# Altium project PnP.PrjPcb (part 2 of 2)

## Sheet ENET.SchDoc: ENET PHY
size 431 x 279 mm; Author: Shivam Sharma; SheetNumber: 9; SheetTotal: 13; SheetRevision: 1.0
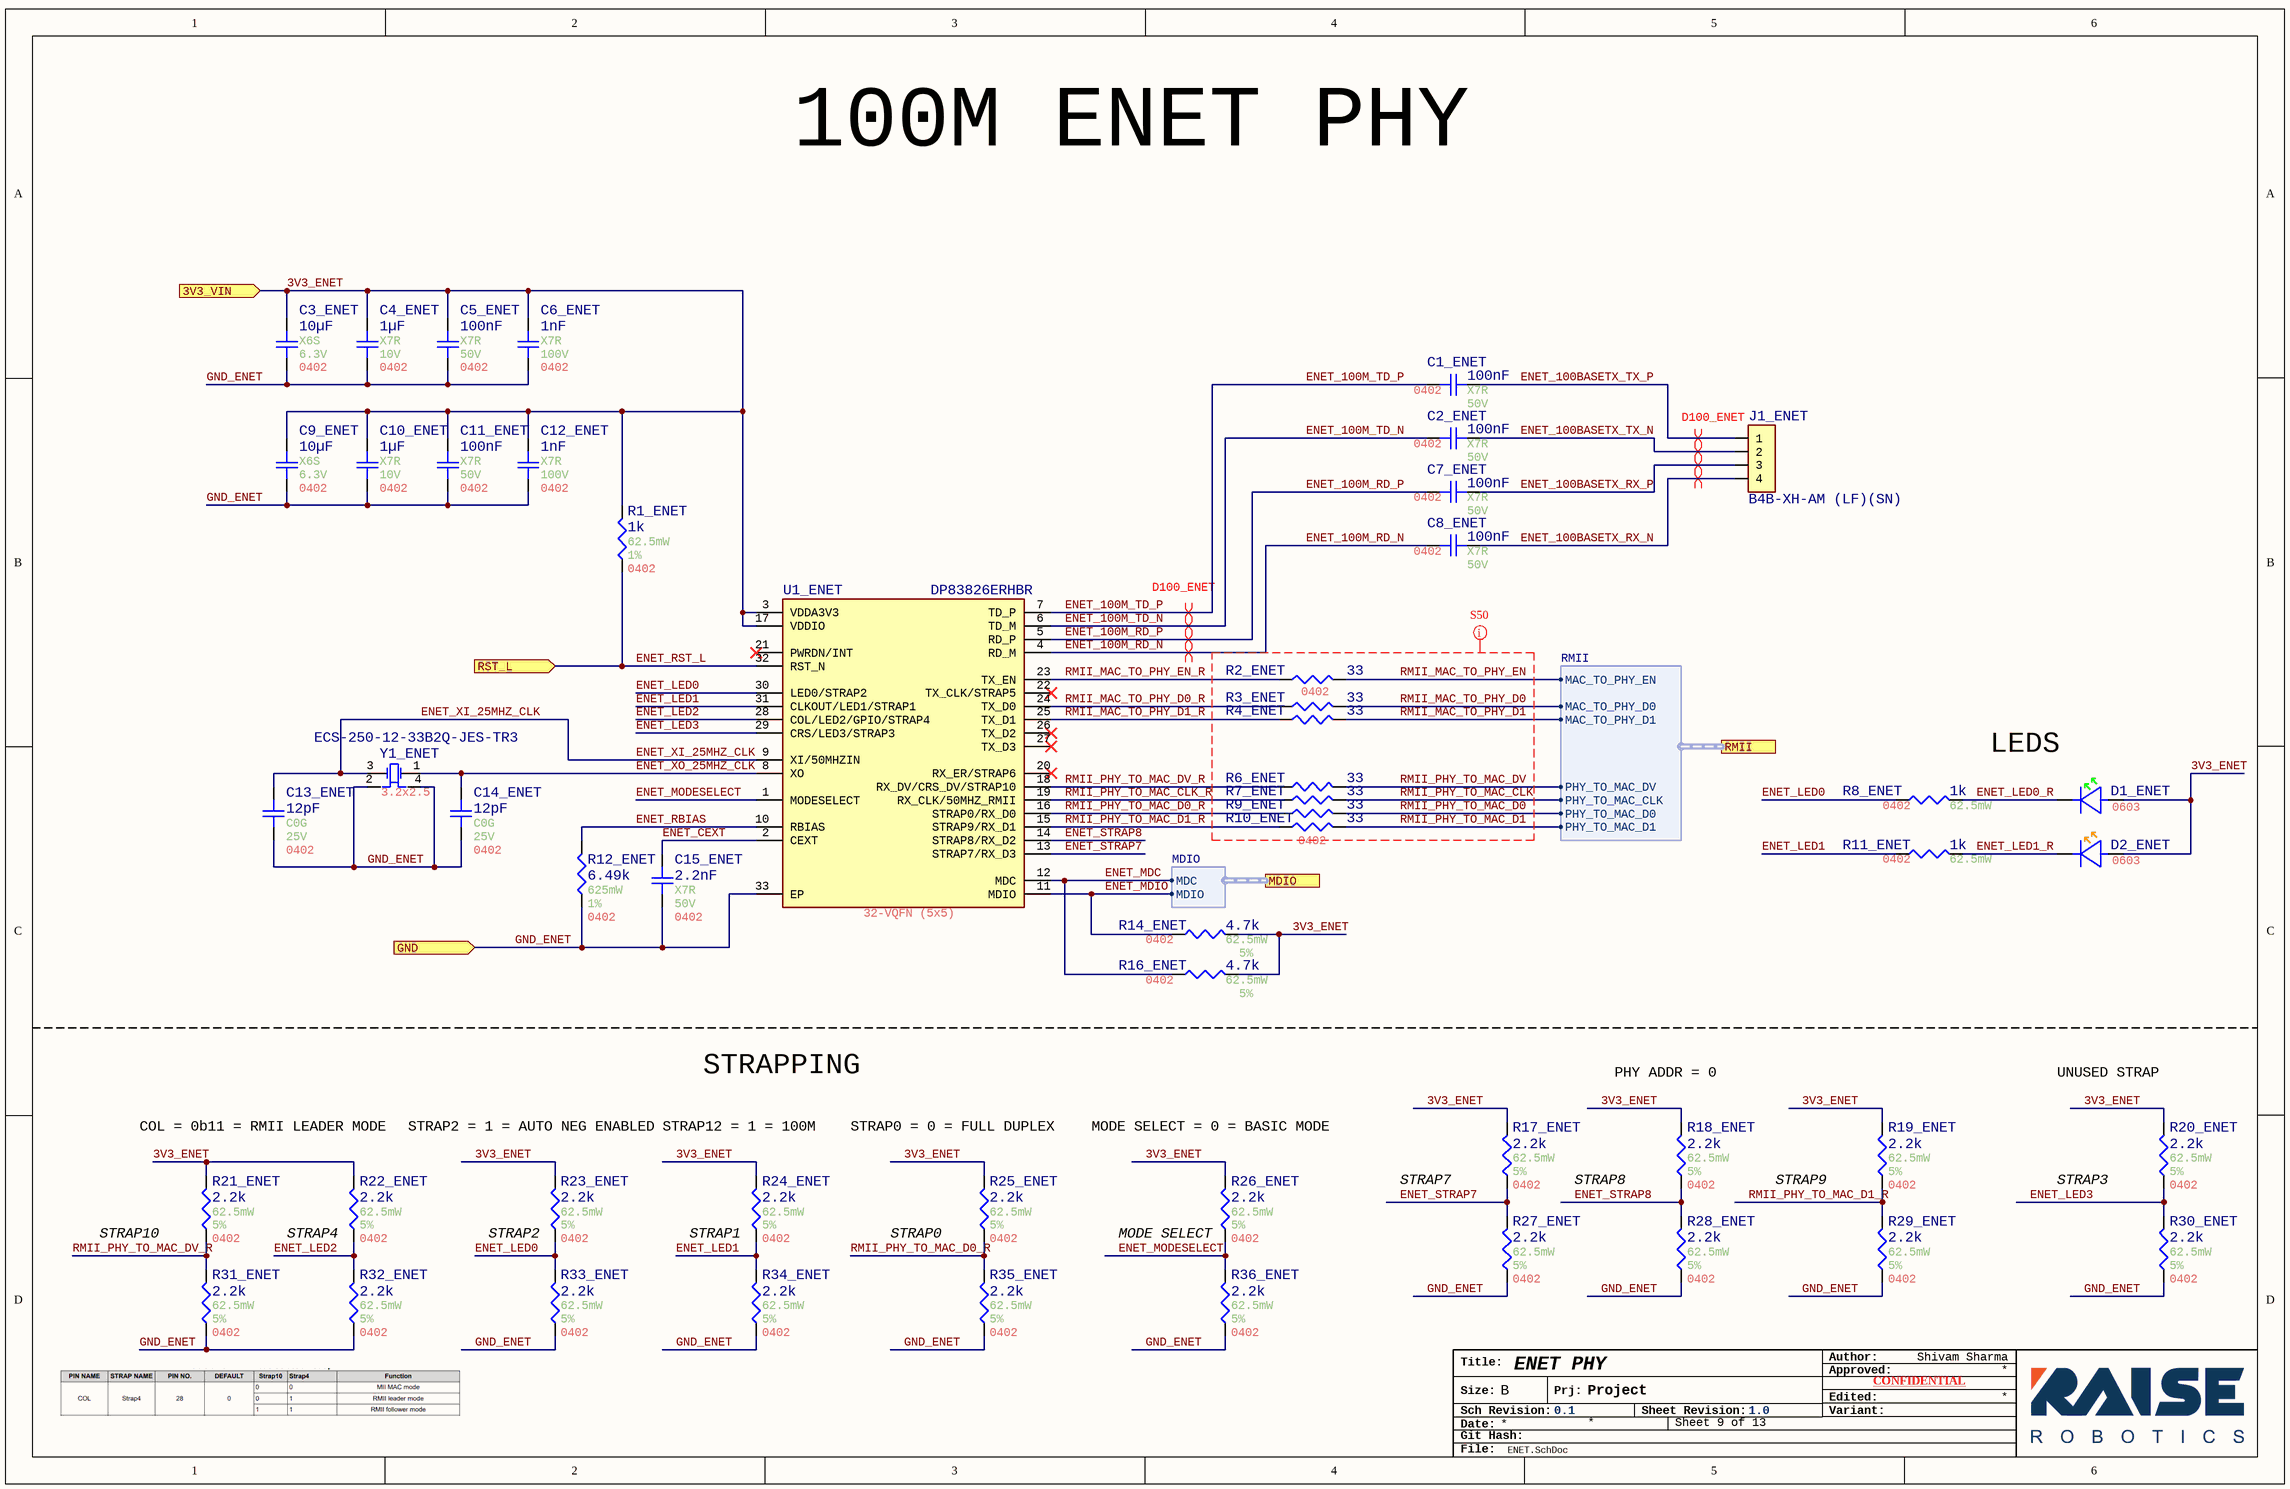
[diagram p6: ENET.SchDoc]

### Parts
C1_ENET  value 100nF  Temperature Coefficient: X7R  Voltage Rating: 50V  Case/Package: 0402  [Generic 0402 capacitor]  (hidden comment: GRT155R71H104KE01D)
C2_ENET  value 100nF  Temperature Coefficient: X7R  Voltage Rating: 50V  Case/Package: 0402  [Generic 0402 capacitor]  (hidden comment: GRT155R71H104KE01D)
C3_ENET  value 10µF  Temperature Coefficient: X6S  Voltage Rating: 6.3V  Case/Package: 0402  [Generic 0402 capacitor]  (hidden comment: GRT155C80J106ME13J)
C4_ENET  value 1µF  Temperature Coefficient: X7R  Voltage Rating: 10V  Case/Package: 0402  [Generic 0402 capacitor]  (hidden comment: MAASL105CD7105MFCA01)
C5_ENET  value 100nF  Temperature Coefficient: X7R  Voltage Rating: 50V  Case/Package: 0402  [Generic 0402 capacitor]  (hidden comment: GRT155R71H104KE01D)
C6_ENET  value 1nF  Temperature Coefficient: X7R  Voltage Rating: 100V  Case/Package: 0402  [Generic 0402 capacitor]  (hidden comment: GCM155R72A102KA37J)
C7_ENET  value 100nF  Temperature Coefficient: X7R  Voltage Rating: 50V  Case/Package: 0402  [Generic 0402 capacitor]  (hidden comment: GRT155R71H104KE01D)
C8_ENET  value 100nF  Temperature Coefficient: X7R  Voltage Rating: 50V  Case/Package: 0402  [Generic 0402 capacitor]  (hidden comment: GRT155R71H104KE01D)
C9_ENET  value 10µF  Temperature Coefficient: X6S  Voltage Rating: 6.3V  Case/Package: 0402  [Generic 0402 capacitor]  (hidden comment: GRT155C80J106ME13J)
C10_ENET  value 1µF  Temperature Coefficient: X7R  Voltage Rating: 10V  Case/Package: 0402  [Generic 0402 capacitor]  (hidden comment: MAASL105CD7105MFCA01)
C11_ENET  value 100nF  Temperature Coefficient: X7R  Voltage Rating: 50V  Case/Package: 0402  [Generic 0402 capacitor]  (hidden comment: GRT155R71H104KE01D)
C12_ENET  value 1nF  Temperature Coefficient: X7R  Voltage Rating: 100V  Case/Package: 0402  [Generic 0402 capacitor]  (hidden comment: GCM155R72A102KA37J)
C13_ENET  value 12pF  Temperature Coefficient: C0G  Voltage Rating: 25V  Case/Package: 0402  [Generic 0402 capacitor]  (hidden comment: GRT1555C1E120JA02J)
C14_ENET  value 12pF  Temperature Coefficient: C0G  Voltage Rating: 25V  Case/Package: 0402  [Generic 0402 capacitor]  (hidden comment: GRT1555C1E120JA02J)
C15_ENET  value 2.2nF  Temperature Coefficient: X7R  Voltage Rating: 50V  Case/Package: 0402  [Generic 0402 capacitor]  (hidden comment: CGA2B2X7R1H222K050BA)
D1_ENET  Case/Package: 0603  [SML-D12P8WT86C]  (hidden comment: SML-D12P8WT86C)
D2_ENET  Case/Package: 0603  [FP-SML-D12-MFG]  (hidden comment: SML-D12D8WT86C)
J1_ENET  B4B-XH-AM (LF)(SN)  [FP-B4B-XH-AM_LF_SN-MFG]
R1_ENET  value 1k  Power: 62.5mW  Tolerance: 1%  Case/Package: 0402  [Generic 0402 Resistor]  (hidden comment: WR04X1001FTL)
R2_ENET  value 33  [Generic 0402 Resistor]  (hidden comment: RMCA0402FT33R0-HP)
R3_ENET  value 33  [Generic 0402 Resistor]  (hidden comment: RMCA0402FT33R0-HP)
R4_ENET  value 33  Case/Package: 0402  [Generic 0402 Resistor]  (hidden comment: RMCA0402FT33R0-HP)
R6_ENET  value 33  [Generic 0402 Resistor]  (hidden comment: RMCA0402FT33R0-HP)
R7_ENET  value 33  [Generic 0402 Resistor]  (hidden comment: RMCA0402FT33R0-HP)
R8_ENET  value 1k  Power: 62.5mW  Case/Package: 0402  [Generic 0402 Resistor]  (hidden comment: WR04X1001FTL)
R9_ENET  value 33  [Generic 0402 Resistor]  (hidden comment: RMCA0402FT33R0-HP)
R10_ENET  value 33  Case/Package: 0402  [Generic 0402 Resistor]  (hidden comment: RMCA0402FT33R0-HP)
R11_ENET  value 1k  Power: 62.5mW  Case/Package: 0402  [Generic 0402 Resistor]  (hidden comment: WR04X1001FTL)
R12_ENET  value 6.49k  Power: 625mW  Tolerance: 1%  Case/Package: 0402  [Generic 0402 Resistor]  (hidden comment: AC0402FR-076K49L)
R14_ENET  value 4.7k  Power: 62.5mW  Tolerance: 5%  Case/Package: 0402  [Generic 0402 Resistor]  (hidden comment: WR04X472JTL)
R16_ENET  value 4.7k  Power: 62.5mW  Tolerance: 5%  Case/Package: 0402  [Generic 0402 Resistor]  (hidden comment: WR04X472JTL)
R17_ENET  value 2.2k  Power: 62.5mW  Tolerance: 5%  Case/Package: 0402  [Generic 0402 Resistor]  (hidden comment: CR0402-JW-222GLF)
R18_ENET  value 2.2k  Power: 62.5mW  Tolerance: 5%  Case/Package: 0402  [Generic 0402 Resistor]  (hidden comment: CR0402-JW-222GLF)
R19_ENET  value 2.2k  Power: 62.5mW  Tolerance: 5%  Case/Package: 0402  [Generic 0402 Resistor]  (hidden comment: CR0402-JW-222GLF)
R20_ENET  value 2.2k  Power: 62.5mW  Tolerance: 5%  Case/Package: 0402  [Generic 0402 Resistor]  (hidden comment: CR0402-JW-222GLF)
R21_ENET  value 2.2k  Power: 62.5mW  Tolerance: 5%  Case/Package: 0402  [Generic 0402 Resistor]  (hidden comment: CR0402-JW-222GLF)
R22_ENET  value 2.2k  Power: 62.5mW  Tolerance: 5%  Case/Package: 0402  [Generic 0402 Resistor]  (hidden comment: CR0402-JW-222GLF)
R23_ENET  value 2.2k  Power: 62.5mW  Tolerance: 5%  Case/Package: 0402  [Generic 0402 Resistor]  (hidden comment: CR0402-JW-222GLF)
R24_ENET  value 2.2k  Power: 62.5mW  Tolerance: 5%  Case/Package: 0402  [Generic 0402 Resistor]  (hidden comment: CR0402-JW-222GLF)
R25_ENET  value 2.2k  Power: 62.5mW  Tolerance: 5%  Case/Package: 0402  [Generic 0402 Resistor]  (hidden comment: CR0402-JW-222GLF)
R26_ENET  value 2.2k  Power: 62.5mW  Tolerance: 5%  Case/Package: 0402  [Generic 0402 Resistor]  (hidden comment: CR0402-JW-222GLF)
R27_ENET  value 2.2k  Power: 62.5mW  Tolerance: 5%  Case/Package: 0402  [Generic 0402 Resistor]  (hidden comment: CR0402-JW-222GLF)
R28_ENET  value 2.2k  Power: 62.5mW  Tolerance: 5%  Case/Package: 0402  [Generic 0402 Resistor]  (hidden comment: CR0402-JW-222GLF)
R29_ENET  value 2.2k  Power: 62.5mW  Tolerance: 5%  Case/Package: 0402  [Generic 0402 Resistor]  (hidden comment: CR0402-JW-222GLF)
R30_ENET  value 2.2k  Power: 62.5mW  Tolerance: 5%  Case/Package: 0402  [Generic 0402 Resistor]  (hidden comment: CR0402-JW-222GLF)
R31_ENET  value 2.2k  Power: 62.5mW  Tolerance: 5%  Case/Package: 0402  [Generic 0402 Resistor]  (hidden comment: CR0402-JW-222GLF)
R32_ENET  value 2.2k  Power: 62.5mW  Tolerance: 5%  Case/Package: 0402  [Generic 0402 Resistor]  (hidden comment: CR0402-JW-222GLF)
R33_ENET  value 2.2k  Power: 62.5mW  Tolerance: 5%  Case/Package: 0402  [Generic 0402 Resistor]  (hidden comment: CR0402-JW-222GLF)
R34_ENET  value 2.2k  Power: 62.5mW  Tolerance: 5%  Case/Package: 0402  [Generic 0402 Resistor]  (hidden comment: CR0402-JW-222GLF)
R35_ENET  value 2.2k  Power: 62.5mW  Tolerance: 5%  Case/Package: 0402  [Generic 0402 Resistor]  (hidden comment: CR0402-JW-222GLF)
R36_ENET  value 2.2k  Power: 62.5mW  Tolerance: 5%  Case/Package: 0402  [Generic 0402 Resistor]  (hidden comment: CR0402-JW-222GLF)
U1_ENET  DP83826ERHBR  Case/Package: 32-VQFN (5x5)  [DP83826ERHBR]
Y1_ENET  ECS-250-12-33B2Q-JES-TR3  Case/Package: 3.2x2.5  [ECS-250-12-33B2Q-JES-TR3]

### Ports
3V3_VIN (in), GND (in), MDIO (harness MDIO), RMII (harness RMII), RST_L (in)

### Harnesses
MDIO: MDIO, MDC
RMII: MAC_TO_PHY_D0, MAC_TO_PHY_D1, PHY_TO_MAC_D0, PHY_TO_MAC_CLK, PHY_TO_MAC_D1, MAC_TO_PHY_EN, PHY_TO_MAC_DV

### Nets
3V3_ENET: C3_ENET.2 C4_ENET.2 C5_ENET.2 C6_ENET.2 C9_ENET.2 C10_ENET.2 C11_ENET.2 C12_ENET.2 D1_ENET.2(A) D2_ENET.2(A) R1_ENET.2 R14_ENET.2 R16_ENET.2 R17_ENET.2 R18_ENET.2 R19_ENET.2 R20_ENET.2 R21_ENET.2 R22_ENET.2 R23_ENET.2 R24_ENET.2 R25_ENET.2 R26_ENET.2 U1_ENET.3(VDDA3V3) U1_ENET.17(VDDIO) ; port 3V3_VIN  [project net 3V3_LOGIC]
GND_ENET: C3_ENET.1 C4_ENET.1 C5_ENET.1 C6_ENET.1 C9_ENET.1 C10_ENET.1 C11_ENET.1 C12_ENET.1 C13_ENET.1 C14_ENET.1 C15_ENET.1 R12_ENET.1 R27_ENET.1 R28_ENET.1 R29_ENET.1 R30_ENET.1 R31_ENET.1 R32_ENET.1 R33_ENET.1 R34_ENET.1 R35_ENET.1 R36_ENET.1 U1_ENET.33(EP) Y1_ENET.2 Y1_ENET.4 ; port GND  [project net GND]
ENET_100BASETX_RX_N: C8_ENET.1 J1_ENET.4
ENET_100BASETX_RX_P: C7_ENET.1 J1_ENET.3
ENET_100BASETX_TX_N: C2_ENET.1 J1_ENET.2
ENET_100BASETX_TX_P: C1_ENET.1 J1_ENET.1
ENET_100M_RD_N: C8_ENET.2 U1_ENET.4(RD_M)
ENET_100M_RD_P: C7_ENET.2 U1_ENET.5(RD_P)
ENET_100M_TD_N: C2_ENET.2 U1_ENET.6(TD_M)
ENET_100M_TD_P: C1_ENET.2 U1_ENET.7(TD_P)
ENET_CEXT: C15_ENET.2 U1_ENET.2(CEXT)
ENET_LED0: R8_ENET.1 R23_ENET.1 R33_ENET.2 U1_ENET.30(LED0/STRAP2)
ENET_LED0_R: D1_ENET.1(C) R8_ENET.2
ENET_LED1: R11_ENET.1 R24_ENET.1 R34_ENET.2 U1_ENET.31(CLKOUT/LED1/STRAP1)
ENET_LED1_R: D2_ENET.1(C) R11_ENET.2
ENET_LED2: R22_ENET.1 R32_ENET.2 U1_ENET.28(COL/LED2/GPIO/STRAP4)
ENET_LED3: R20_ENET.1 R30_ENET.2 U1_ENET.29(CRS/LED3/STRAP3)
ENET_MDC: R16_ENET.1 U1_ENET.12(MDC) ; port MDIO.MDC
ENET_MDIO: R14_ENET.1 U1_ENET.11(MDIO) ; port MDIO.MDIO
ENET_MODESELECT: R26_ENET.1 R36_ENET.2 U1_ENET.1(MODESELECT)
ENET_RBIAS: R12_ENET.2 U1_ENET.10(RBIAS)
ENET_RST_L: R1_ENET.1 U1_ENET.32(RST_N) ; port RST_L
ENET_STRAP7: R17_ENET.1 R27_ENET.2 U1_ENET.13(STRAP7/RX_D3)
ENET_STRAP8: R18_ENET.1 R28_ENET.2 U1_ENET.14(STRAP8/RX_D2)
ENET_XI_25MHZ_CLK: C13_ENET.2 U1_ENET.9(XI/50MHZIN) Y1_ENET.3
ENET_XO_25MHZ_CLK: C14_ENET.2 U1_ENET.8(XO) Y1_ENET.1
RMII_MAC_TO_PHY_D0: R3_ENET.2 ; port RMII.MAC_TO_PHY_D0
RMII_MAC_TO_PHY_D0_R: R3_ENET.1 U1_ENET.24(TX_D0)
RMII_MAC_TO_PHY_D1: R4_ENET.2 ; port RMII.MAC_TO_PHY_D1
RMII_MAC_TO_PHY_D1_R: R4_ENET.1 U1_ENET.25(TX_D1)
RMII_MAC_TO_PHY_EN: R2_ENET.2 ; port RMII.MAC_TO_PHY_EN
RMII_MAC_TO_PHY_EN_R: R2_ENET.1 U1_ENET.23(TX_EN)
RMII_PHY_TO_MAC_CLK: R7_ENET.2 ; port RMII.PHY_TO_MAC_CLK
RMII_PHY_TO_MAC_CLK_R: R7_ENET.1 U1_ENET.19(RX_CLK/50MHZ_RMII)
RMII_PHY_TO_MAC_D0: R9_ENET.2 ; port RMII.PHY_TO_MAC_D0
RMII_PHY_TO_MAC_D0_R: R9_ENET.1 R25_ENET.1 R35_ENET.2 U1_ENET.16(STRAP0/RX_D0)
RMII_PHY_TO_MAC_D1: R10_ENET.2 ; port RMII.PHY_TO_MAC_D1
RMII_PHY_TO_MAC_D1_R: R10_ENET.1 R19_ENET.1 R29_ENET.2 U1_ENET.15(STRAP9/RX_D1)
RMII_PHY_TO_MAC_DV: R6_ENET.2 ; port RMII.PHY_TO_MAC_DV
RMII_PHY_TO_MAC_DV_R: R6_ENET.1 R21_ENET.1 R31_ENET.2 U1_ENET.18(RX_DV/CRS_DV/STRAP10)

Not connected (* = marked no-connect by the designer): U1_ENET 20(RX_ER/STRAP6)* 21(PWRDN/INT)* 22(TX_CLK/STRAP5)* 26(TX_D2)* 27(TX_D3)*

### Layout directives
differential pair; differential pair class D100_ENET: ENET_100BASETX_RX_N, ENET_100BASETX_RX_P, ENET_100BASETX_TX_N, ENET_100BASETX_TX_P, ENET_100M_RD_N, ENET_100M_RD_P, ENET_100M_TD_N, ENET_100M_TD_P
net class S50: RMII_MAC_TO_PHY_D0, RMII_MAC_TO_PHY_D1, RMII_MAC_TO_PHY_EN, RMII_PHY_TO_MAC_CLK, RMII_PHY_TO_MAC_D0, RMII_PHY_TO_MAC_D1, RMII_PHY_TO_MAC_DV

### Notes on the sheet
- 100M ENET PHY
- LEDS
- STRAPPING
- PHY ADDR = 0
- UNUSED STRAP
- COL = 0b11 = RMII LEADER MODE
- STRAP2 = 1 = AUTO NEG ENABLED
- STRAP12 = 1 = 100M
- STRAP0 = 0 = FULL DUPLEX
- MODE SELECT = 0 = BASIC MODE
- STRAP10
- (near R22_ENET) STRAP4
- (near R23_ENET) STRAP2
- (near R24_ENET) STRAP1
- STRAP0
- (near R26_ENET) MODE SELECT
- STRAP7
- STRAP8
- STRAP9
- STRAP3
- Title:
- Author:
- Approved:
- Size:
- Date:
- Git Hash:
- Sch Revision:
- B
- Prj:
- Sheet Revision:
- Variant:
- Edited:
- CONFIDENTIAL
- File:

### Library data of the parts
C1_ENET C2_ENET C5_ENET C7_ENET C8_ENET C11_ENET = CMP-001-00084-12: as C1 on sheet Top; Reach SVHC Compliant: Yes; Mounting Technology: Surface Mount; Termination: Wraparound; Pins: 2; Packaging: Tape and Reel; Package Shape: Rectangular; Multilayer: Yes; Tolerance: 10%; Max Operating Temperature: 125°C; Terminal Finish: Nickel; Capacitor Type: Ceramic; Dielectric Material: Ceramic; Min Operating Temperature: -55°C; RoHS Compliant: Yes
C3_ENET C9_ENET = CMP-001-00108-2: as C9_MCU on sheet MCU; Mounting Technology: Surface Mount; Max Operating Temperature: 105°C; Min Operating Temperature: -55°C; Tolerance: 20%; Pins: 2; RoHS Compliant: Yes; Capacitor Type: Ceramic
C4_ENET C10_ENET = CMP-001-00104-2: Cap Cer 1UF 20V X7T 0402; Capacitor Type: Ceramic; AECQ: Yes; Tolerance: 20%; Max Operating Temperature: 125°C; Min Operating Temperature: -55°C; Mounting Technology: Surface Mount; RoHS Compliant: Yes; Pins: 2
C6_ENET C12_ENET = CMP-001-00101-2: Ceramic Capacitor, Multilayer, Ceramic, 100V, 10% +Tol, 10% -Tol, X7R, 15% TC, 0.001uF, Surface Mount, 0402; AECQ: Yes; Pins: 2; Tolerance: 10%; Max Operating Temperature: 125°C; Capacitor Type: Ceramic; Mounting Technology: SMD; Min Operating Temperature: -55°C
C13_ENET C14_ENET = CMP-001-00109-2: Ceramic Capacitor, Multilayer, Ceramic, 25V, 5% +Tol, 5% -Tol, C0G, 30ppm/Cel TC, 0.000012uF, Surface Mount, 0402; AECQ: Yes; Pins: 2; Mounting Technology: Surface Mount; Min Operating Temperature: -55°C; RoHS Compliant: Yes; Max Operating Temperature: 125°C; Tolerance: 5%; Capacitor Type: Ceramic
C15_ENET = CMP-001-00093-4: 50V 2.2nF X7R 卤10% 0402 Multilayer Ceramic Capacitors MLCC - SMD/SMT ROHS; Multilayer: Yes; Tolerance: 10%; Max Operating Temperature: 150°C; AECQ: Yes; Reach SVHC Compliant: Yes; Package Shape: Rectangular; Dielectric Material: Ceramic; Min Operating Temperature: -55°C; Packaging: Tape and Reel; RoHS Compliant: Yes; Capacitor Type: Ceramic; Mounting Technology: Surface Mount; Pins: 2
D1_ENET = CMP-007-00039-1: Green 560nm LED Indication - Discrete 2.2V 0603 (1608 Metric); Forward Voltage: 2.2V; Pins: 2; Colour: Green
D2_ENET = CMP-007-00038-1: Orange 605nm LED Indication - Discrete 2.2V 0603 (1608 Metric); Colour: Orange; Forward Voltage: 2.2V; Pins: 2
J1_ENET = CMP-002-00133-1: Header, Xh, Top, 4Way, 2.5Mm, Boss;; Manufacturer: JST; Max Current Rating: 3A; Gender: Male; Pitch: 2.4892mm; Voltage Rating: 250V; Length: 12.4mm; Min Operating Temperature: -25°C; Max Operating Temperature: 85°C; Pins: 4; Manufacturer Series: XH; Case/Package: THT; Height: 7mm; Connector Type: Header
R1_ENET R8_ENET R11_ENET = CMP-009-00182-8: Fixed Resistor, Metal Glaze/thick Film, 0.0625W, 1000ohm, 50V, 1% +/-Tol, 100ppm/Cel, Surface Mount, 0402; Manufacturer Part Number: Blank; Package Width: 0.5mm; Rated Temperature: 70°C; AECQ: No; Package Length: 1mm; Additional Feature: LASER TRIMMABLE; Package Height: 0.35mm; Temperature Coefficient (ppm/Cel): 100; RoHS Compliant: Yes; Working Voltage: 50V; Min Operating Temperature: -55°C; Pins: 2; Reach SVHC Compliant: Yes; Technology: METAL GLAZE/THICK FILM; Terminal Finish: Nickel; Max Operating Temperature: 155°C; Resistor Type: FIXED RESISTOR; Package Shape: Rectangular; Mounting Technology: Surface Mount; Termination: Wraparound; JESD-609 Code: e3; Packaging: Tape and Reel; Construction: Chip
  R8_ENET R11_ENET: Tolerance: 1%
R2_ENET R3_ENET R4_ENET R6_ENET R7_ENET R9_ENET R10_ENET = CMP-009-00205-4: Fixed Resistor, Metal Glaze/thick Film, 0.1W, 33ohm, 50V, 1% +/-Tol, 100ppm/Cel, Surface Mount, 0402; Power: 625mW; AECQ: Yes; Tolerance: 1%; Max Operating Temperature: 155°C; Pins: 2; Min Operating Temperature: -55°C; Voltage Rating: 50V; Mounting Technology: SMD
  R2_ENET R3_ENET R6_ENET R7_ENET R9_ENET: Case/Package: 0402
R12_ENET = CMP-009-00204-3: Fixed Resistor, Metal Glaze/thick Film, 0.0625W, 6490ohm, 50V, 1% +/-Tol, 100ppm/Cel, Surface Mount, 0402; AECQ: Yes; Min Operating Temperature: -55°C; Max Operating Temperature: 155°C; Pins: 2; Mounting Technology: SMD
R14_ENET R16_ENET = CMP-009-00184-8: Fixed Resistor, Metal Glaze/thick Film, 0.0625W, 4700ohm, 50V, 5% +/-Tol, 100ppm/Cel, Surface Mount, 0402; Manufacturer Part Number: Blank; Package Height: 0.35mm; Package Length: 1mm; Rated Temperature: 70°C; Package Width: 0.5mm; AECQ: No; Temperature Coefficient (ppm/Cel): 200; Additional Feature: LASER TRIMMABLE; Mounting Technology: Surface Mount; Technology: METAL GLAZE/THICK FILM; RoHS Compliant: Yes; Resistor Type: FIXED RESISTOR; Package Shape: Rectangular; Pins: 2; Construction: Chip; Terminal Finish: Nickel; Max Operating Temperature: 155°C; Working Voltage: 50V; Packaging: Tape and Reel; Termination: Wraparound; JESD-609 Code: e3; Reach SVHC Compliant: Yes; Min Operating Temperature: -55°C
R17_ENET R18_ENET R19_ENET R20_ENET R21_ENET R22_ENET R23_ENET R24_ENET R25_ENET R26_ENET R27_ENET R28_ENET R29_ENET R30_ENET R31_ENET R32_ENET R33_ENET R34_ENET R35_ENET R36_ENET = CMP-009-00183-8: Fixed Resistor, Metal Glaze/thick Film, 0.0625W, 2200ohm, 50V, 5% +/-Tol, 200ppm/Cel, Surface Mount, 0402; Manufacturer Part Number: Blank; Package Width: 0.5mm; Rated Temperature: 70°C; AECQ: No; Package Length: 1mm; Package Height: 0.35mm; Temperature Coefficient (ppm/Cel): 200; RoHS Compliant: Yes; Working Voltage: 50V; Min Operating Temperature: -55°C; Pins: 2; Reach SVHC Compliant: No; Technology: RUTHENIUM OXIDE; Terminal Finish: Nickel; Max Operating Temperature: 125°C; Resistor Type: FIXED RESISTOR; Package Shape: Rectangular; Mounting Technology: Surface Mount; Termination: Wraparound; JESD-609 Code: e3; Packaging: Tape and Reel; Construction: Chip
U1_ENET = CMP-031-00009-2: Ethernet Transceiver, 1-Trnsvr, PQCC32; AECQ: No; Max Operating Temperature: 105°C; Min Operating Temperature: -40°C; Pins: 32; MPN: DP83826ERHBR
Y1_ENET = CMP-003-00030-1: Crystal 25.000 Mhz 12PF SMD; AECQ: Yes; ESR: 50; Frequency: 25MHz; Mounting Technology: SMD; Min Operating Temperature: -40°C; Load Capacitance: 12pF; Pins: 4; Max Operating Temperature: 125°C

## Sheet steppers.SchDoc: Steppers
size 431 x 279 mm; Author: Shivam Sharma; SheetNumber: 11; SheetTotal: 13; SheetRevision: 1.0
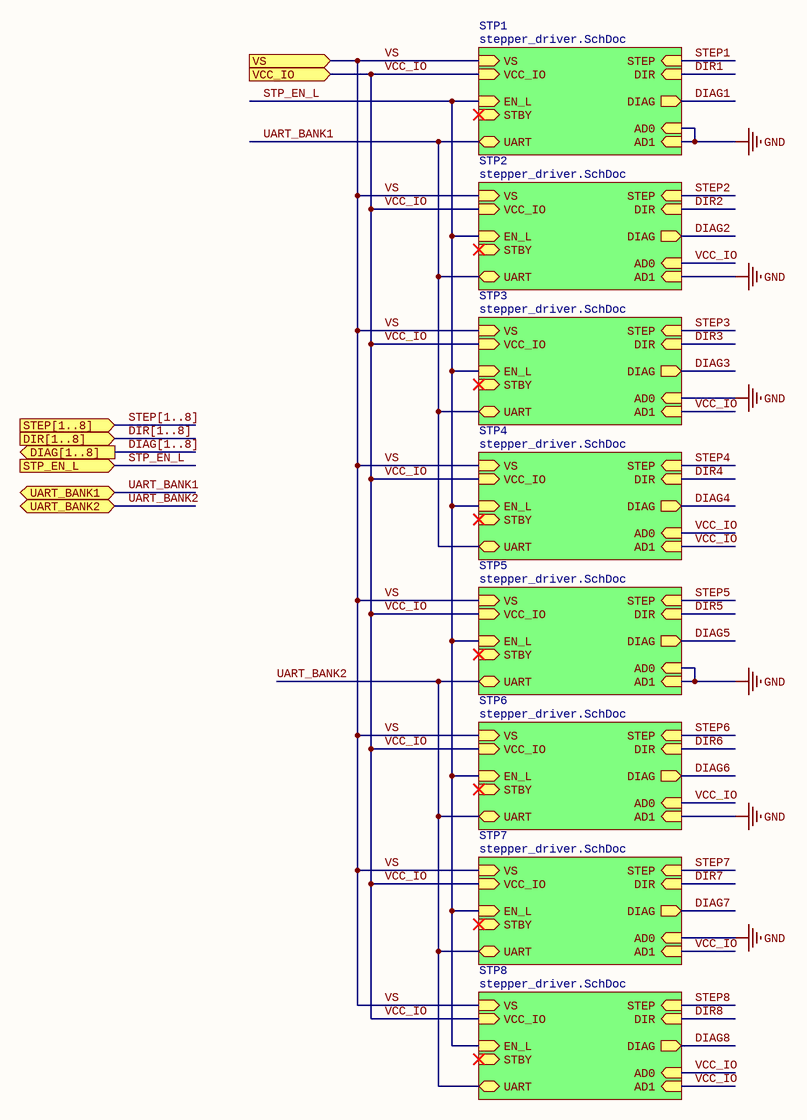
[diagram p7: steppers.SchDoc]

### Sub-sheets
STP1 = stepper_driver.SchDoc: VS (in), VCC_IO (in), STBY (in), EN_L (in), UART (bidir), DIR (in), STEP (in), AD0 (in), AD1 (in), DIAG (out)
STP2 = stepper_driver.SchDoc: VS (in), VCC_IO (in), STBY (in), EN_L (in), UART (bidir), DIR (in), STEP (in), AD0 (in), AD1 (in), DIAG (out)
STP3 = stepper_driver.SchDoc: VS (in), VCC_IO (in), STBY (in), EN_L (in), UART (bidir), DIR (in), STEP (in), AD0 (in), AD1 (in), DIAG (out)
STP4 = stepper_driver.SchDoc: VS (in), VCC_IO (in), STBY (in), EN_L (in), UART (bidir), DIR (in), STEP (in), AD0 (in), AD1 (in), DIAG (out)
STP5 = stepper_driver.SchDoc: VS (in), VCC_IO (in), STBY (in), EN_L (in), UART (bidir), DIR (in), STEP (in), AD0 (in), AD1 (in), DIAG (out)
STP6 = stepper_driver.SchDoc: VS (in), VCC_IO (in), STBY (in), EN_L (in), UART (bidir), DIR (in), STEP (in), AD0 (in), AD1 (in), DIAG (out)
STP7 = stepper_driver.SchDoc: VS (in), VCC_IO (in), STBY (in), EN_L (in), UART (bidir), DIR (in), STEP (in), AD0 (in), AD1 (in), DIAG (out)
STP8 = stepper_driver.SchDoc: VS (in), VCC_IO (in), STBY (in), EN_L (in), UART (bidir), DIR (in), STEP (in), AD0 (in), AD1 (in), DIAG (out)

### Ports
DIAG[1..8] (out), DIR[1..8] (in), STEP[1..8] (in), STP_EN_L (in), UART_BANK1 (bidir), UART_BANK2 (bidir), VCC_IO (in), VS (in)

### Nets
GND: sheet STP1/AD0, sheet STP1/AD1, sheet STP2/AD1, sheet STP3/AD0, sheet STP5/AD0, sheet STP5/AD1, sheet STP6/AD1, sheet STP7/AD0
VCC_IO: port VCC_IO, sheet STP1/VCC_IO, sheet STP2/VCC_IO, sheet STP2/AD0, sheet STP3/VCC_IO, sheet STP3/AD1, sheet STP4/VCC_IO, sheet STP4/AD0, sheet STP4/AD1, sheet STP5/VCC_IO, sheet STP6/VCC_IO, sheet STP6/AD0, sheet STP7/VCC_IO, sheet STP7/AD1, sheet STP8/VCC_IO, sheet STP8/AD0, sheet STP8/AD1  [project net 3V3_LOGIC]
VS: port VS, sheet STP1/VS, sheet STP2/VS, sheet STP3/VS, sheet STP4/VS, sheet STP5/VS, sheet STP6/VS, sheet STP7/VS, sheet STP8/VS  [project net 24V_MAIN]
STP_EN_L: port STP_EN_L, sheet STP1/EN_L, sheet STP2/EN_L, sheet STP3/EN_L, sheet STP4/EN_L, sheet STP5/EN_L, sheet STP6/EN_L, sheet STP7/EN_L, sheet STP8/EN_L  [project net STEPPERS_EN]
UART_BANK1: port UART_BANK1, sheet STP1/UART, sheet STP2/UART, sheet STP3/UART, sheet STP4/UART
UART_BANK2: port UART_BANK2, sheet STP5/UART, sheet STP6/UART, sheet STP7/UART, sheet STP8/UART

### Buses and harness runs
bus DIAG[1..8] = port DIAG[1..8]
bus DIR[1..8] = port DIR[1..8]
bus STEP[1..8] = port STEP[1..8]

### Notes on the sheet
- Title:
- Author:
- Approved:
- Size:
- Date:
- Git Hash:
- Sch Revision:
- B
- Prj:
- Sheet Revision:
- Variant:
- Edited:
- CONFIDENTIAL
- File:

## Sheet stepper_driver.SchDoc
size 431 x 279 mm; Author: Shivam Sharma; SheetNumber: 13; SheetTotal: 14
Used 8 times, as channels STP/STP1, STP/STP2, STP/STP3, STP/STP4, STP/STP5, STP/STP6, STP/STP7, STP/STP8. Parts and nets are listed once, with the designators drawn on the sheet.
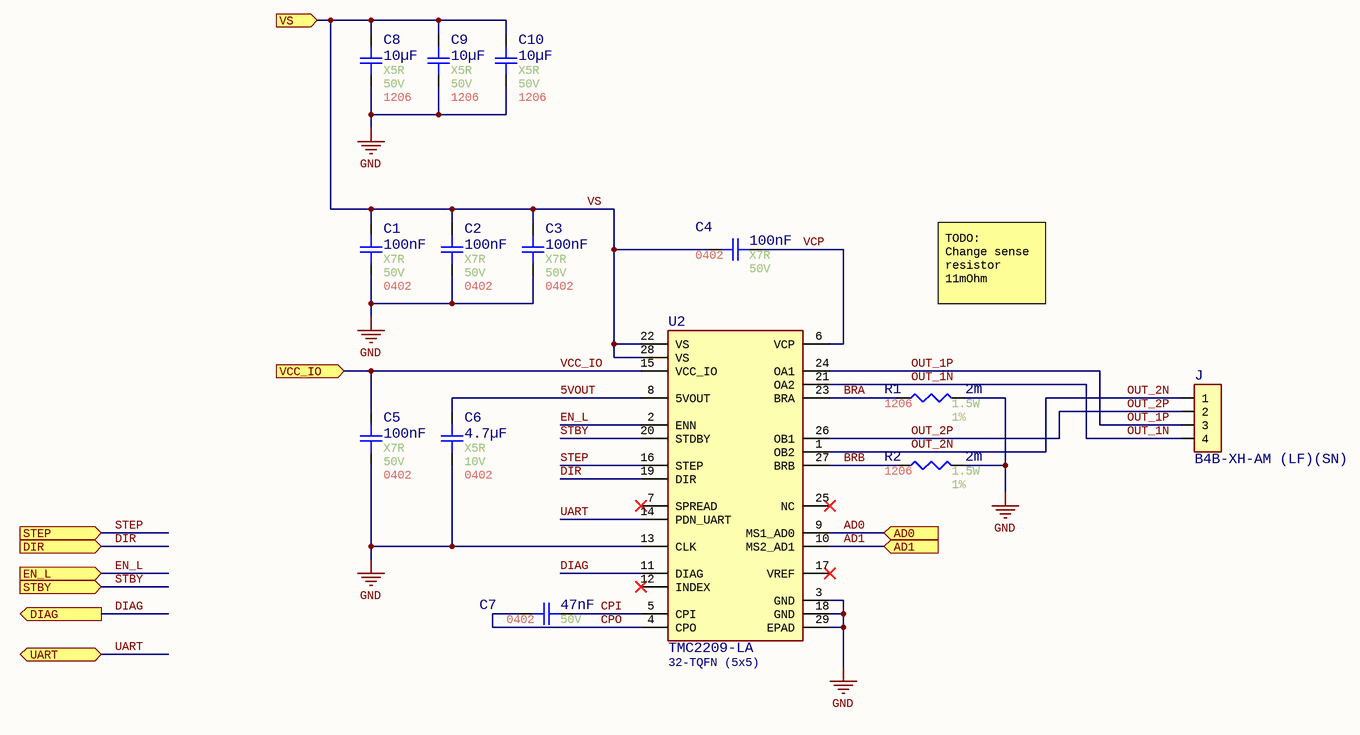
[diagram p8: stepper_driver.SchDoc]

### Parts
C1  value 100nF  Temperature Coefficient: X7R  Voltage Rating: 50V  Case/Package: 0402  [Generic 0402 capacitor]  (hidden comment: GRT155R71H104KE01D)
C2  value 100nF  Temperature Coefficient: X7R  Voltage Rating: 50V  Case/Package: 0402  [Generic 0402 capacitor]  (hidden comment: GRT155R71H104KE01D)
C3  value 100nF  Temperature Coefficient: X7R  Voltage Rating: 50V  Case/Package: 0402  [Generic 0402 capacitor]  (hidden comment: GRT155R71H104KE01D)
C4  value 100nF  Temperature Coefficient: X7R  Voltage Rating: 50V  Case/Package: 0402  [Generic 0402 capacitor]  (hidden comment: GRT155R71H104KE01D)
C5  value 100nF  Temperature Coefficient: X7R  Voltage Rating: 50V  Case/Package: 0402  [Generic 0402 capacitor]  (hidden comment: GRT155R71H104KE01D)
C6  value 4.7µF  Temperature Coefficient: X5R  Voltage Rating: 10V  Case/Package: 0402  [Generic 0402 capacitor]  (hidden comment: GRT155R61A475ME13D)
C7  value 47nF  Voltage Rating: 50V  Case/Package: 0402  [Generic 0402 capacitor]  (hidden comment: GRM155R71H473KE14D)
C8  value 10µF  Temperature Coefficient: X5R  Voltage Rating: 50V  Case/Package: 1206  [Generic 1206 Capacitor]  (hidden comment: CL31A106MBHNNNE)
C9  value 10µF  Temperature Coefficient: X5R  Voltage Rating: 50V  Case/Package: 1206  [Generic 1206 Capacitor]  (hidden comment: CL31A106MBHNNNE)
C10  value 10µF  Temperature Coefficient: X5R  Voltage Rating: 50V  Case/Package: 1206  [Generic 1206 Capacitor]  (hidden comment: CL31A106MBHNNNE)
J  B4B-XH-AM (LF)(SN)  [FP-B4B-XH-AM_LF_SN-MFG]
R1  value 2m  Power: 1.5W  Tolerance: 1%  Case/Package: 1206  [Generic 1206 resistor]  (hidden comment: PA1206FRM670R002L)
R2  value 2m  Power: 1.5W  Tolerance: 1%  Case/Package: 1206  [Generic 1206 resistor]  (hidden comment: PA1206FRM670R002L)
U2  TMC2209-LA  Case/Package: 32-TQFN (5x5)  [QFN-28_5x5x0.9mm_P0.5mm]

### Ports
AD0 (in), AD1 (in), DIAG (out), DIR (in), EN_L (in), STBY (in), STEP (in), UART (bidir), VCC_IO (in), VS (in)

### Nets
GND: C1.1 C2.1 C3.1 C5.1 C6.1 C8.1 C9.1 C10.1 R1.2 R2.2 U2.3(GND) U2.13(CLK) U2.18(GND) U2.29(EPAD)
5VOUT: C6.2 U2.8(5VOUT)
AD0: U2.9(MS1_AD0) ; port AD0
AD1: U2.10(MS2_AD1) ; port AD1
BRA: R1.1 U2.23(BRA)
BRB: R2.1 U2.27(BRB)
CPI: C7.1 U2.5(CPI)
CPO: C7.2 U2.4(CPO)
DIAG: U2.11(DIAG) ; port DIAG
DIR: U2.19(DIR) ; port DIR
EN_L: U2.2(ENN) ; port EN_L
OUT_1N: J.4 U2.21(OA2)
OUT_1P: J.3 U2.24(OA1)
OUT_2N: J.1 U2.1(OB2)
OUT_2P: J.2 U2.26(OB1)
STBY: U2.20(STDBY) ; port STBY
STEP: U2.16(STEP) ; port STEP
UART: U2.14(PDN_UART) ; port UART
VCC_IO: C5.2 U2.15(VCC_IO) ; port VCC_IO
VCP: C4.1 U2.6(VCP)
VS: C1.2 C2.2 C3.2 C4.2 C8.2 C9.2 C10.2 U2.22(VS) U2.28(VS) ; port VS

Not connected (* = marked no-connect by the designer): U2 7(SPREAD)* 12(INDEX)* 17(VREF)* 25(NC)*

### Channels
STP/STP1: designators end in _STP1; ports AD0=GND AD1=GND DIAG=DIAG1 DIR=DIR1 EN_L=STEPPERS_EN STBY=STBY_STP1 STEP=STEP1 UART=UART_BANK1 VCC_IO=3V3_LOGIC VS=24V_MAIN
STP/STP2: designators end in _STP2; ports AD0=3V3_LOGIC AD1=GND DIAG=DIAG2 DIR=DIR2 EN_L=STEPPERS_EN STBY=STBY_STP2 STEP=STEP2 UART=UART_BANK1 VCC_IO=3V3_LOGIC VS=24V_MAIN
STP/STP3: designators end in _STP3; ports AD0=GND AD1=3V3_LOGIC DIAG=DIAG3 DIR=DIR3 EN_L=STEPPERS_EN STBY=STBY_STP3 STEP=STEP3 UART=UART_BANK1 VCC_IO=3V3_LOGIC VS=24V_MAIN
STP/STP4: designators end in _STP4; ports AD0=3V3_LOGIC AD1=3V3_LOGIC DIAG=DIAG4 DIR=DIR4 EN_L=STEPPERS_EN STBY=STBY_STP4 STEP=STEP4 UART=UART_BANK1 VCC_IO=3V3_LOGIC VS=24V_MAIN
STP/STP5: designators end in _STP5; ports AD0=GND AD1=GND DIAG=DIAG5 DIR=DIR5 EN_L=STEPPERS_EN STBY=STBY_STP5 STEP=STEP5 UART=UART_BANK2 VCC_IO=3V3_LOGIC VS=24V_MAIN
STP/STP6: designators end in _STP6; ports AD0=3V3_LOGIC AD1=GND DIAG=DIAG6 DIR=DIR6 EN_L=STEPPERS_EN STBY=STBY_STP6 STEP=STEP6 UART=UART_BANK2 VCC_IO=3V3_LOGIC VS=24V_MAIN
STP/STP7: designators end in _STP7; ports AD0=GND AD1=3V3_LOGIC DIAG=DIAG7 DIR=DIR7 EN_L=STEPPERS_EN STBY=STBY_STP7 STEP=STEP7 UART=UART_BANK2 VCC_IO=3V3_LOGIC VS=24V_MAIN
STP/STP8: designators end in _STP8; ports AD0=3V3_LOGIC AD1=3V3_LOGIC DIAG=DIAG8 DIR=DIR8 EN_L=STEPPERS_EN STBY=STBY_STP8 STEP=STEP8 UART=UART_BANK2 VCC_IO=3V3_LOGIC VS=24V_MAIN

### Notes on the sheet
- TODO:
  Change sense resistor 11mOhm
- Title:
- Author:
- Approved:
- Size:
- Date:
- Git Hash:
- Sch Revision:
- B
- Prj:
- SCH PN:
- Variant:
- Edited:
- CONFIDENTIAL
- File:

### Library data of the parts
C1-C5 = CMP-001-00084-12: Ceramic Capacitor, Multilayer, Ceramic, 50V, 10% +Tol, 10% -Tol, X7R, 15% TC, 0.1uF, Surface Mount, 0402; Multilayer: Yes; Terminal Finish: Nickel; Capacitor Type: Ceramic; Package Shape: Rectangular; Reach SVHC Compliant: Yes; Max Operating Temperature: 125°C; RoHS Compliant: Yes; Termination: Wraparound; Packaging: Tape and Reel; AECQ: Yes; Pins: 2; Dielectric Material: Ceramic; Min Operating Temperature: -55°C; Tolerance: 10%; Mounting Technology: Surface Mount
C6 = CMP-001-00085-5: Ceramic Capacitor, Multilayer, Ceramic, 10V, 20% +Tol, 20% -Tol, X5R, 15% TC, 4.7uF, Surface Mount, 0402; Multilayer: Yes; Tolerance: 0%; Reach SVHC Compliant: Yes; Tolerance (fill in as +-): 20%; Packaging: Tape and Reel; Dielectric Material: Ceramic; Mounting Technology: Surface Mount; RoHS Compliant: Yes; Tolerance  (fill in as +-): 20%; Rated DC Voltage (URdc): 10V; Package Shape: Rectangular; Termination: Wraparound; Pins: 2; Max Operating Temperature: 85°C; Capacitor Type: Ceramic; Min Operating Temperature: -55°C; AECQ: Yes
C7 = CMP-001-00113-1: 50V 47nF X7R ±10% 0402 Multilayer Ceramic Capacitors MLCC - SMD/SMT ROHS; AECQ: No; Mounting Technology: SMD; Tolerance: 10%; Pins: 2; Min Operating Temperature: -55°C; Max Operating Temperature: 125°C; Capacitor Type: Ceramic
C8-C10 = CMP-001-00092-6: Ceramic Capacitor, Multilayer, Ceramic, 50V, 20% +Tol, 20% -Tol, X5R, 15% TC, 10uF, Surface Mount, 1206; AECQ: No; Multilayer: Yes; Reach SVHC Compliant: Yes; Package Shape: Rectangular; Temperature Characteristics Code: X5R; RoHS Compliant: Yes; Max Operating Temperature: 85°C; Mounting Technology: Surface Mount; Capacitor Type: Ceramic; Pins: 2; Packaging: Tape and Reel; Terminal Finish: Nickel; Tolerance: 20%; Termination: Wraparound; Dielectric Material: Ceramic; JESD-609 Code: e3; Min Operating Temperature: -55°C
J = CMP-002-00133-1: Header, Xh, Top, 4Way, 2.5Mm, Boss;; Manufacturer: JST; Max Current Rating: 3A; Gender: Male; Pitch: 2.4892mm; Voltage Rating: 250V; Length: 12.4mm; Min Operating Temperature: -25°C; Max Operating Temperature: 85°C; Pins: 4; Manufacturer Series: XH; Case/Package: THT; Height: 7mm; Connector Type: Header
R1 R2 = CMP-009-00231-1: Res 0.002 Ohm 1% 1.5W 1206; Manufacturer Part Number: Blank; AECQ: Yes; Max Operating Temperature: 170°C; Min Operating Temperature: -55°C; Pins: 2; Mounting Technology: SMD
U2 = CMP-031-00019-2: Step/Direction StealthChop Stepper Motor Driver Two-Phase 4.75V to 29V 28-Pin QFN Tray; MPN: TMC5240ATJ+T; Min Supply Voltage: 1.5V; AECQ: No; Max Supply Voltage: 29V; Min Operating Temperature: -40°C; Pins: 32; Max Operating Temperature: 125°C; Mounting Technology: SMD

## Sheet pressure_sensor.SchDoc
size 431 x 279 mm; Author: Shivam Sharma; SheetNumber: 14; SheetTotal: 14
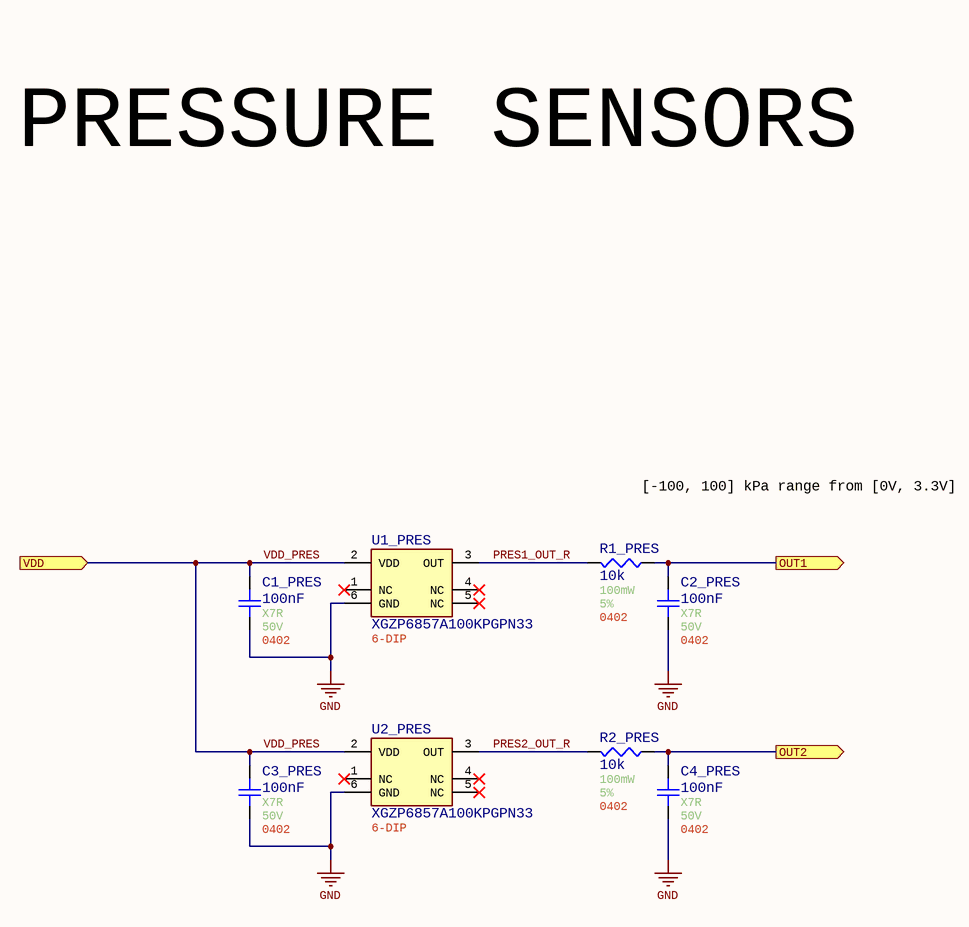
[diagram p9: pressure_sensor.SchDoc]

### Parts
C1_PRES  value 100nF  Temperature Coefficient: X7R  Voltage Rating: 50V  Case/Package: 0402  [Generic 0402 capacitor]  (hidden comment: GRT155R71H104KE01D)
C2_PRES  value 100nF  Temperature Coefficient: X7R  Voltage Rating: 50V  Case/Package: 0402  [Generic 0402 capacitor]  (hidden comment: GRT155R71H104KE01D)
C3_PRES  value 100nF  Temperature Coefficient: X7R  Voltage Rating: 50V  Case/Package: 0402  [Generic 0402 capacitor]  (hidden comment: GRT155R71H104KE01D)
C4_PRES  value 100nF  Temperature Coefficient: X7R  Voltage Rating: 50V  Case/Package: 0402  [Generic 0402 capacitor]  (hidden comment: GRT155R71H104KE01D)
R1_PRES  value 10k  Power: 100mW  Tolerance: 5%  Case/Package: 0402  [Generic 0402 Resistor]  (hidden comment: ERJ-2GEJ103X)
R2_PRES  value 10k  Power: 100mW  Tolerance: 5%  Case/Package: 0402  [Generic 0402 Resistor]  (hidden comment: ERJ-2GEJ103X)
U1_PRES  XGZP6857A100KPGPN33  Case/Package: 6-DIP  [6-DIP_XGZP6857]
U2_PRES  XGZP6857A100KPGPN33  Case/Package: 6-DIP  [6-DIP_XGZP6857]

### Ports
OUT1 (out), OUT2 (out), VDD (in)

### Nets
GND: C1_PRES.1 C2_PRES.1 C3_PRES.1 C4_PRES.1 U1_PRES.6(GND) U2_PRES.6(GND)
VDD_PRES: C1_PRES.2 C3_PRES.2 U1_PRES.2(VDD) U2_PRES.2(VDD) ; port VDD  [project net 3V3_LOGIC]
PRES1_OUT_R: R1_PRES.2 U1_PRES.3(OUT)
PRES2_OUT_R: R2_PRES.2 U2_PRES.3(OUT)
PRESS1: C2_PRES.2 R1_PRES.1 ; port OUT1
PRESS2: C4_PRES.2 R2_PRES.1 ; port OUT2

Not connected (* = marked no-connect by the designer): U1_PRES 1(NC)* 4(NC)* 5(NC)*; U2_PRES 1(NC)* 4(NC)* 5(NC)*

### Notes on the sheet
- PRESSURE SENSORS
- [-100, 100] kPa range from [0V, 3.3V]
- Title:
- Author:
- Approved:
- Size:
- Date:
- Git Hash:
- Sch Revision:
- B
- Prj:
- SCH PN:
- Variant:
- Edited:
- CONFIDENTIAL
- File:

### Library data of the parts
C1_PRES C2_PRES C3_PRES C4_PRES = CMP-001-00084-12: as C1 on sheet stepper_driver; Terminal Finish: Nickel; Capacitor Type: Ceramic; Package Shape: Rectangular; Reach SVHC Compliant: Yes; Max Operating Temperature: 125°C; RoHS Compliant: Yes; Termination: Wraparound; Packaging: Tape and Reel; AECQ: Yes; Pins: 2; Dielectric Material: Ceramic; Min Operating Temperature: -55°C; Tolerance: 10%; Mounting Technology: Surface Mount
R1_PRES R2_PRES = CMP-009-00185-9: Res Thick Film 0402 10K Ohm 5% 1/10W ±200ppm/°C Molded SMD Punched Carrier T/R; AECQ: No; Mounting Technology: Surface Mount; Max Operating Temperature: 155°C; Min Operating Temperature: -55°C; RoHS Compliant: Yes; Pins: 2
U1_PRES U2_PRES = CMP-010-00049-1: Pressure Sensor 14.5PSI(-100 - 100)kPa; Sensor Type: Barometric Pressure; Nominal Supply Voltage: 3.3V; Max Operating Temperature: 100°C; Pins: 6; Min Operating Temperature: -20°C; Mounting Technology: SMD

## Sheet ESP32.SchDoc
size 431 x 279 mm; Author: Shivam Sharma; SheetNumber: 7; SheetTotal: 13
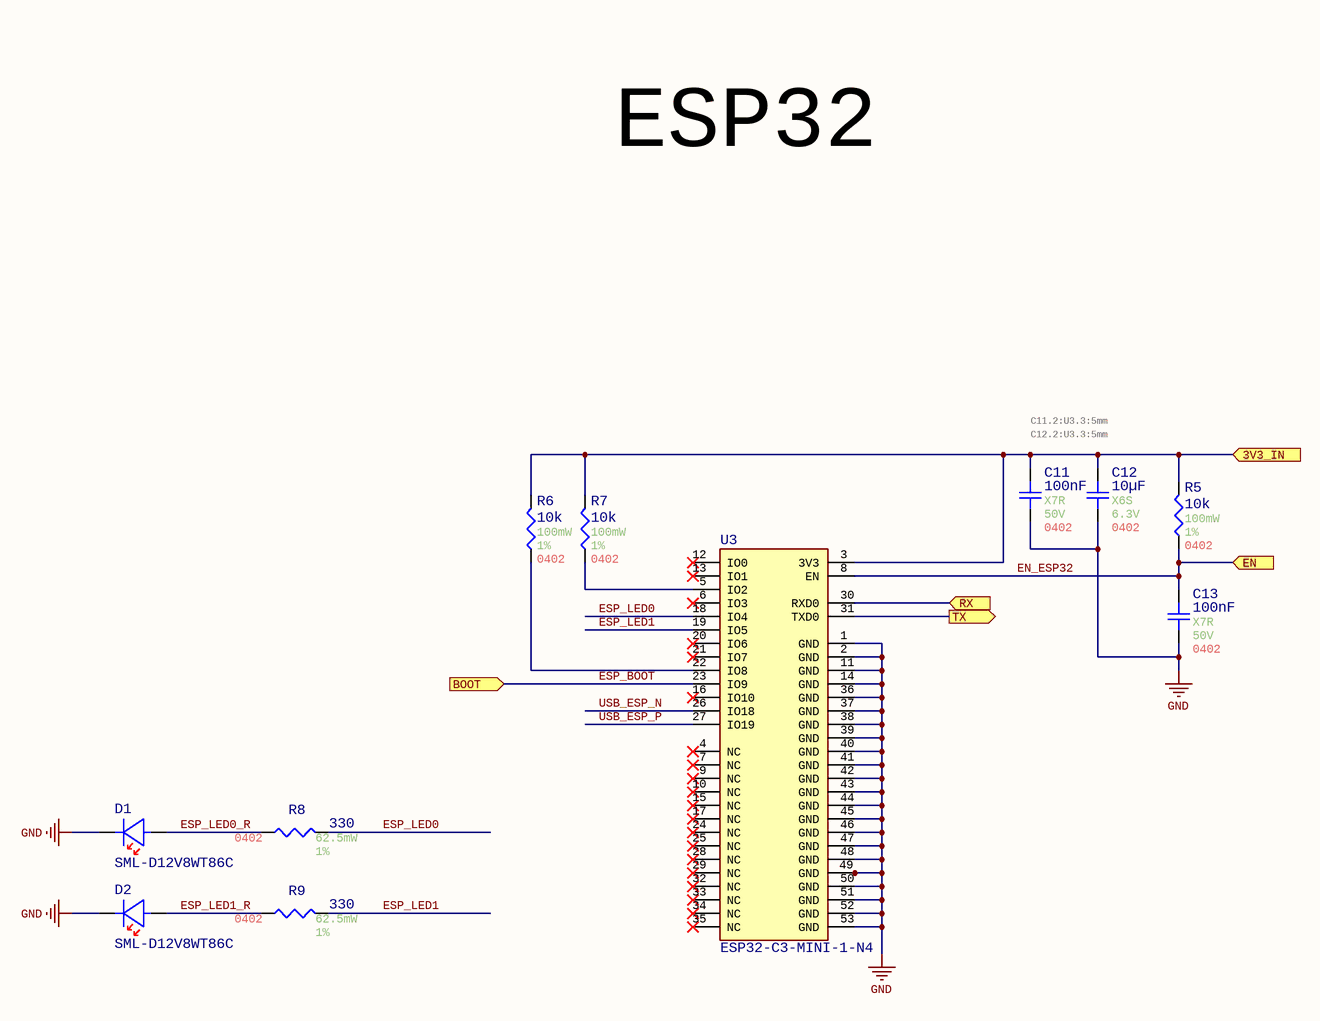
[diagram p10: ESP32.SchDoc]

### Parts
C11  value 100nF  Temperature Coefficient: X7R  Voltage Rating: 50V  Case/Package: 0402  PlaceNear: C11.2:U3.3:5mm  [Generic 0402 capacitor]  (hidden comment: GRT155R71H104KE01D)
C12  value 10µF  Temperature Coefficient: X6S  Voltage Rating: 6.3V  Case/Package: 0402  PlaceNear: C12.2:U3.3:5mm  [Generic 0402 capacitor]  (hidden comment: GRT155C80J106ME13J)
C13  value 100nF  Temperature Coefficient: X7R  Voltage Rating: 50V  Case/Package: 0402  [Generic 0402 capacitor]  (hidden comment: GRT155R71H104KE01D)
D1  SML-D12V8WT86C  [FP-SML-D12-MFG]
D2  SML-D12V8WT86C  [FP-SML-D12-MFG]
R5  value 10k  Power: 100mW  Tolerance: 1%  Case/Package: 0402  [Generic 0402 Resistor]  (hidden comment: RNCP0402FTD10K0)
R6  value 10k  Power: 100mW  Tolerance: 1%  Case/Package: 0402  [Generic 0402 Resistor]  (hidden comment: RNCP0402FTD10K0)
R7  value 10k  Power: 100mW  Tolerance: 1%  Case/Package: 0402  [Generic 0402 Resistor]  (hidden comment: RNCP0402FTD10K0)
R8  value 330  Power: 62.5mW  Tolerance: 1%  Case/Package: 0402  [Generic 0402 Resistor]  (hidden comment: RMCF0402FT330R)
R9  value 330  Power: 62.5mW  Tolerance: 1%  Case/Package: 0402  [Generic 0402 Resistor]  (hidden comment: RMCF0402FT330R)
U3  ESP32-C3-MINI-1-N4  [ESP32-C3-MINI-1-N4]

### Ports
3V3_IN (in), BOOT (in), EN (in), RX (in), TX (out)

### Nets
3V3_LOGIC: C11.2 C12.2 R5.2 R6.2 R7.2 U3.3(3V3) ; port 3V3_IN
GND: C11.1 C12.1 C13.1 D1.1(C) D2.1(C) U3.1(GND) U3.2(GND) U3.11(GND) U3.14(GND) U3.36(GND) U3.37(GND) U3.38(GND) U3.39(GND) U3.40(GND) U3.41(GND) U3.42(GND) U3.43(GND) U3.44(GND) U3.45(GND) U3.46(GND) U3.47(GND) U3.48(GND) U3.49_1(GND) U3.49_2(GND) U3.49_3(GND) U3.49_4(GND) U3.49_5(GND) U3.49_6(GND) U3.49_7(GND) U3.49_8(GND) U3.49_9(GND) U3.50(GND) U3.51(GND) U3.52(GND) U3.53(GND)
EN_ESP32: C13.2 R5.1 U3.8(EN) ; port EN
ESP_BOOT: U3.23(IO9) ; port BOOT
ESP_LED0: R8.2 U3.18(IO4)
ESP_LED0_R: D1.2(A) R8.1
ESP_LED1: R9.2 U3.19(IO5)
ESP_LED1_R: D2.2(A) R9.1
UART_ESP_TO_MCU: U3.31(TXD0) ; port TX
UART_MCU_TO_ESP: U3.30(RXD0) ; port RX
USB_ESP_N: U3.26(IO18)
USB_ESP_P: U3.27(IO19)
NetR6_1: R6.1 U3.22(IO8)
NetR7_1: R7.1 U3.5(IO2)

Not connected (* = marked no-connect by the designer): U3 4(NC)* 6(IO3)* 7(NC)* 9(NC)* 10(NC)* 12(IO0)* 13(IO1)* 15(NC)* 16(IO10)* 17(NC)* 20(IO6)* 21(IO7)* 24(NC)* 25(NC)* 28(NC)* 29(NC)* 32(NC)* 33(NC)* 34(NC)* 35(NC)*

### Notes on the sheet
- ESP32
- Title:
- Author:
- Approved:
- Size:
- Date:
- Git Hash:
- Sch Revision:
- B
- Prj:
- SCH PN:
- Variant:
- Edited:
- CONFIDENTIAL
- File:
- (in symbol CMP-020-00031-1) 49

### Library data of the parts
C11 C13 = CMP-001-00084-12: Ceramic Capacitor, Multilayer, Ceramic, 50V, 10% +Tol, 10% -Tol, X7R, 15% TC, 0.1uF, Surface Mount, 0402; AECQ: Yes; Reach SVHC Compliant: Yes; Mounting Technology: Surface Mount; Termination: Wraparound; Pins: 2; Packaging: Tape and Reel; Package Shape: Rectangular; Multilayer: Yes; Tolerance: 10%; Max Operating Temperature: 125°C; Terminal Finish: Nickel; Capacitor Type: Ceramic; Dielectric Material: Ceramic; Min Operating Temperature: -55°C; RoHS Compliant: Yes
C12 = CMP-001-00108-2: Multilayer Ceramic Capacitors MLCC - SMD/SMT 0402 10uF 6.3VDC 20% X6S AEC-Q200; AECQ: Yes; Mounting Technology: Surface Mount; Max Operating Temperature: 105°C; Min Operating Temperature: -55°C; Tolerance: 20%; Pins: 2; RoHS Compliant: Yes; Capacitor Type: Ceramic
D1 D2 = CMP-007-00036-1: Red 630nm LED Indication - Discrete 2.2V 0603 (1608 Metric); Case/Package: 0603; Forward Voltage: 2.2V; Colour: Red; Pins: 2
R5-R7 = CMP-009-00242-1: Fixed Resistor, Thin Film, 0.1W, 10000ohm, 50V, 1% +/-Tol, 100ppm/Cel, Surface Mount, 0402; Manufacturer Part Number: Blank; AECQ: Yes; Pins: 2; Max Operating Temperature: 155°C; Voltage Rating: 50V; Mounting Technology: SMD; Min Operating Temperature: -55°C
R8 R9 = CMP-009-00225-1: Res Thick Film 0402 330 Ohm 1% 0.063W ±100ppm/°C Molded SMD Paper T/R; AECQ: Yes; Mounting Technology: Surface Mount; Max Operating Temperature: 155°C; RoHS Compliant: Yes; Pins: 2; Min Operating Temperature: -55°C
U3 = CMP-020-00031-1: Module; Wi-Fi/Bluetooth; transceiver; 4MB FLASH/PSRAM/400KB SRAM/384KB ROM; 3.0-3.6V; 13.2x16.6x2.4mm; Min Supply Voltage: 3V; Frequency: 160MHz; Max Supply Voltage: 3.6V; RoHS Compliant: Yes; Max Operating Temperature: 85°C; Case/Package: 53-SMD Module; Min Operating Temperature: -40°C

## Nets that join several sheets
3V3_LOGIC: Top (C1.2 R1.2 U1.21 U1.23), Power (R7_PWR.2), PWR/LDO2 (C3_PWR_LDO2.2 C4_PWR_LDO2.2 U1_PWR_LDO2.5), CAN0 (C1_CAN0.1 U1_CAN0.5), CAN1 (C1_CAN1.1 U1_CAN1.5), ENET (25 pins), STP/STP1 (C5_STP1.2 U2_STP1.15), STP/STP2 (C5_STP2.2 U2_STP2.9 U2_STP2.15), STP/STP3 (C5_STP3.2 U2_STP3.10 U2_STP3.15), STP/STP4 (C5_STP4.2 U2_STP4.9 U2_STP4.10 U2_STP4.15), STP/STP5 (C5_STP5.2 U2_STP5.15), STP/STP6 (C5_STP6.2 U2_STP6.9 U2_STP6.15), STP/STP7 (C5_STP7.2 U2_STP7.10 U2_STP7.15), STP/STP8 (C5_STP8.2 U2_STP8.9 U2_STP8.10 U2_STP8.15), pressure_sensor (C1_PRES.2 C3_PRES.2 U1_PRES.2 U2_PRES.2), ESP32 (6 pins)
3V3_MCU: MCU (26 pins), Power (R6_PWR.2), PWR/LDO1 (C3_PWR_LDO1.2 C4_PWR_LDO1.2 U1_PWR_LDO1.5)
5V0_LOGIC: Power (6 pins), PWR/LDO1 (C1_PWR_LDO1.2 C2_PWR_LDO1.2 U1_PWR_LDO1.1 U1_PWR_LDO1.3), PWR/LDO2 (C1_PWR_LDO2.2 C2_PWR_LDO2.2 U1_PWR_LDO2.1 U1_PWR_LDO2.3), CAN0 (C2_CAN0.1 U1_CAN0.3), CAN1 (C2_CAN1.1 U1_CAN1.3)
5V0_USB: Top (J1.A4 J1.B4), Power (U3_PWR.6)
24V_MAIN: Top (J1_I2C.1 J2_I2C.1), Power (5 pins), 5V_Buck (5 pins), CAN0 (J_CAN0.1), CAN1 (J_CAN1.1), STP/STP1 (9 pins), STP/STP2 (9 pins), STP/STP3 (9 pins), STP/STP4 (9 pins), STP/STP5 (9 pins), STP/STP6 (9 pins), STP/STP7 (9 pins), STP/STP8 (9 pins)
GND: Top (15 pins), MCU (32 pins), Power (21 pins), 5V_Buck (7 pins), PWR/LDO1 (6 pins), PWR/LDO2 (6 pins), CAN0 (8 pins), CAN1 (8 pins), ENET (25 pins), STP/STP1 (16 pins), STP/STP2 (15 pins), STP/STP3 (15 pins), STP/STP4 (14 pins), STP/STP5 (16 pins), STP/STP6 (15 pins), STP/STP7 (15 pins), STP/STP8 (14 pins), pressure_sensor (6 pins), ESP32 (35 pins)
5V0_BUCK: Power (R11_PWR.2 U3_PWR.3 U3_PWR.5), 5V_Buck (5 pins)
CAN0_MCU_TO_PHY_DATA: MCU (U1_MCU.96), CAN0 (U1_CAN0.1)
CAN0_PHY_TO_MCU_DATA: MCU (U1_MCU.95), CAN0 (U1_CAN0.4)
CAN1_MCU_TO_PHY_DATA: MCU (U1_MCU.92), CAN1 (U1_CAN1.1)
CAN1_PHY_TO_MCU_DATA: MCU (U1_MCU.91), CAN1 (U1_CAN1.4)
DIAG1: MCU (U1_MCU.55), STP/STP1 (U2_STP1.11)
DIAG2: MCU (U1_MCU.56), STP/STP2 (U2_STP2.11)
DIAG3: MCU (U1_MCU.57), STP/STP3 (U2_STP3.11)
DIAG4: MCU (U1_MCU.58), STP/STP4 (U2_STP4.11)
DIAG5: MCU (U1_MCU.59), STP/STP5 (U2_STP5.11)
DIAG6: MCU (U1_MCU.60), STP/STP6 (U2_STP6.11)
DIAG7: MCU (U1_MCU.61), STP/STP7 (U2_STP7.11)
DIAG8: MCU (U1_MCU.62), STP/STP8 (U2_STP8.11)
DIR1: MCU (U1_MCU.38), STP/STP1 (U2_STP1.19)
DIR2: MCU (U1_MCU.39), STP/STP2 (U2_STP2.19)
DIR3: MCU (U1_MCU.40), STP/STP3 (U2_STP3.19)
DIR4: MCU (U1_MCU.41), STP/STP4 (U2_STP4.19)
DIR5: MCU (U1_MCU.42), STP/STP5 (U2_STP5.19)
DIR6: MCU (U1_MCU.43), STP/STP6 (U2_STP6.19)
DIR7: MCU (U1_MCU.44), STP/STP7 (U2_STP7.19)
DIR8: MCU (U1_MCU.45), STP/STP8 (U2_STP8.19)
ENET_MDC: MCU (U1_MCU.16), ENET (R16_ENET.1 U1_ENET.12)
ENET_MDIO: MCU (U1_MCU.24), ENET (R14_ENET.1 U1_ENET.11)
ENET_RST_L: MCU (U1_MCU.15), ENET (R1_ENET.1 U1_ENET.32)
FLASH1: Top (J2.1), MCU (U1_MCU.7)
FLASH2: Top (J2.2), MCU (U1_MCU.18)
PRESS1: MCU (U1_MCU.28), pressure_sensor (C2_PRES.2 R1_PRES.1)
PRESS2: MCU (U1_MCU.29), pressure_sensor (C4_PRES.2 R2_PRES.1)
RMII_MAC_TO_PHY_D0: MCU (U1_MCU.51), ENET (R3_ENET.2)
RMII_MAC_TO_PHY_D1: MCU (U1_MCU.52), ENET (R4_ENET.2)
RMII_MAC_TO_PHY_EN: MCU (U1_MCU.47), ENET (R2_ENET.2)
RMII_PHY_TO_MAC_CLK: MCU (U1_MCU.23), ENET (R7_ENET.2)
RMII_PHY_TO_MAC_D0: MCU (U1_MCU.32), ENET (R9_ENET.2)
RMII_PHY_TO_MAC_D1: MCU (U1_MCU.33), ENET (R10_ENET.2)
RMII_PHY_TO_MAC_DV: MCU (U1_MCU.31), ENET (R6_ENET.2)
STEP1: MCU (U1_MCU.97), STP/STP1 (U2_STP1.16)
STEP2: MCU (U1_MCU.98), STP/STP2 (U2_STP2.16)
STEP3: MCU (U1_MCU.1), STP/STP3 (U2_STP3.16)
STEP4: MCU (U1_MCU.2), STP/STP4 (U2_STP4.16)
STEP5: MCU (U1_MCU.3), STP/STP5 (U2_STP5.16)
STEP6: MCU (U1_MCU.4), STP/STP6 (U2_STP6.16)
STEP7: MCU (U1_MCU.5), STP/STP7 (U2_STP7.16)
STEP8: MCU (U1_MCU.37), STP/STP8 (U2_STP8.16)
STEPPERS_EN: MCU (U1_MCU.36), STP/STP1 (U2_STP1.2), STP/STP2 (U2_STP2.2), STP/STP3 (U2_STP3.2), STP/STP4 (U2_STP4.2), STP/STP5 (U2_STP5.2), STP/STP6 (U2_STP6.2), STP/STP7 (U2_STP7.2), STP/STP8 (U2_STP8.2)
TRIGGER1: Top (J2.3), MCU (U1_MCU.93)
TRIGGER2: Top (J2.4), MCU (U1_MCU.17)
UART_BANK1: MCU (U1_MCU.80), STP/STP1 (U2_STP1.14), STP/STP2 (U2_STP2.14), STP/STP3 (U2_STP3.14), STP/STP4 (U2_STP4.14)
UART_BANK2: MCU (U1_MCU.90), STP/STP5 (U2_STP5.14), STP/STP6 (U2_STP6.14), STP/STP7 (U2_STP7.14), STP/STP8 (U2_STP8.14)
UART_ESP_TO_MCU: MCU (U1_MCU.64), ESP32 (U3.31)
UART_MCU_TO_ESP: MCU (U1_MCU.63), ESP32 (U3.30)
USB_DATA_N: Top (J1.A7 J1.B7), MCU (U1_MCU.70)
USB_DATA_P: Top (J1.A6 J1.B6), MCU (U1_MCU.71)

## Assembly variants
Main: not fitted R17_ENET R18_ENET R19_ENET R20_ENET R25_ENET R26_ENET R31_ENET R32_ENET R33_ENET R34_ENET